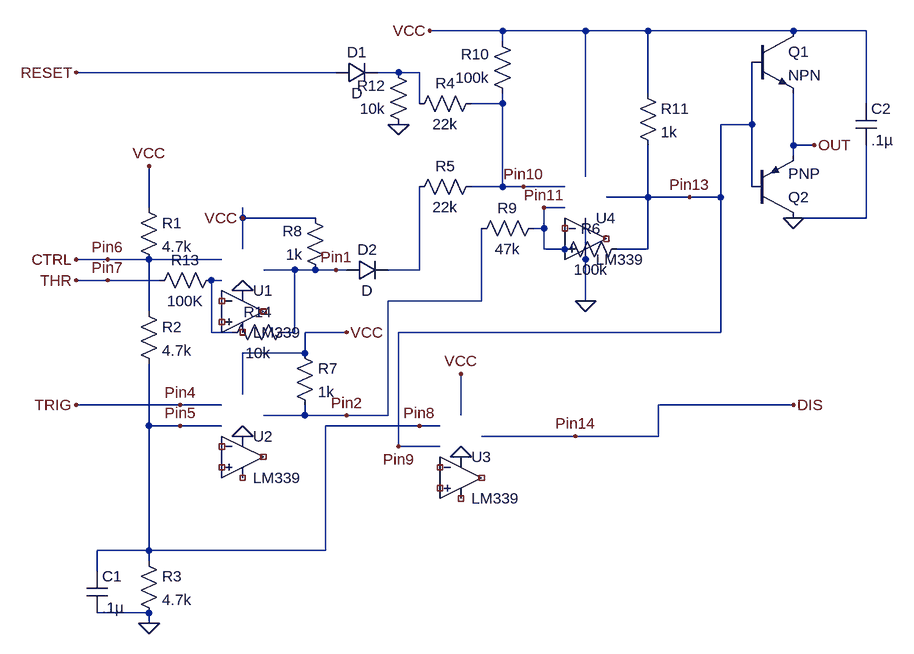
[diagram p0: schematic 555_linear.asc]
555_linear.asc, the LTspice schematic file:
Version 4
SHEET 1 1280 708
WIRE 672 -224 560 -224
WIRE 800 -224 672 -224
WIRE 896 -224 800 -224
WIRE 1120 -224 896 -224
WIRE 1232 -224 1120 -224
WIRE 672 -208 672 -224
WIRE 416 -160 16 -160
WIRE 512 -160 480 -160
WIRE 544 -160 512 -160
WIRE 896 -128 896 -224
WIRE 544 -112 544 -160
WIRE 672 -112 672 -128
WIRE 672 -112 624 -112
WIRE 1232 -112 1232 -224
WIRE 1056 -80 1056 -176
WIRE 1056 -80 1008 -80
WIRE 1120 -48 1120 -128
WIRE 1152 -48 1120 -48
WIRE 1120 -32 1120 -48
WIRE 800 0 800 -224
WIRE 672 16 672 -112
WIRE 672 16 624 16
WIRE 704 16 672 16
WIRE 768 16 704 16
WIRE 1056 16 1056 -80
WIRE 896 32 896 -48
WIRE 896 32 832 32
WIRE 960 32 896 32
WIRE 1008 32 1008 -80
WIRE 1008 32 960 32
WIRE 128 48 128 -16
WIRE 768 48 736 48
WIRE 272 64 272 48
WIRE 384 64 272 64
WIRE 1232 64 1232 -48
WIRE 1232 64 1120 64
WIRE 736 80 736 48
WIRE 736 80 720 80
WIRE 272 112 272 64
WIRE 736 112 736 80
WIRE 768 112 736 112
WIRE 896 112 896 32
WIRE 896 112 848 112
WIRE 64 128 16 128
WIRE 128 128 64 128
WIRE 240 128 128 128
WIRE 352 144 304 144
WIRE 384 144 352 144
WIRE 416 144 384 144
WIRE 432 144 416 144
WIRE 544 144 544 16
WIRE 544 144 496 144
WIRE 64 160 16 160
WIRE 144 160 64 160
WIRE 240 160 224 160
WIRE 640 192 640 80
WIRE 640 192 496 192
WIRE 800 192 800 64
WIRE 128 208 128 128
WIRE 224 240 224 160
WIRE 256 240 224 240
WIRE 352 240 352 144
WIRE 352 240 336 240
WIRE 432 240 368 240
WIRE 1008 240 1008 32
WIRE 1008 240 512 240
WIRE 368 272 368 240
WIRE 368 272 272 272
WIRE 272 336 272 272
WIRE 176 352 16 352
WIRE 240 352 176 352
WIRE 1120 352 912 352
WIRE 368 368 368 352
WIRE 368 368 304 368
WIRE 432 368 368 368
WIRE 496 368 496 192
WIRE 496 368 432 368
WIRE 608 368 608 304
WIRE 128 384 128 288
WIRE 176 384 128 384
WIRE 240 384 176 384
WIRE 544 384 400 384
WIRE 576 384 544 384
WIRE 784 400 640 400
WIRE 912 400 912 352
WIRE 912 400 784 400
WIRE 512 416 512 240
WIRE 576 416 512 416
WIRE 128 576 128 384
WIRE 128 576 48 576
WIRE 400 576 400 384
WIRE 400 576 128 576
WIRE 128 592 128 576
WIRE 48 608 48 576
WIRE 128 672 48 672
WIRE 128 688 128 672
FLAG 272 176 0
FLAG 272 400 0
FLAG 272 64 VCC
FLAG 432 240 VCC
FLAG 16 160 THR
FLAG 16 128 CTRL
FLAG 16 352 TRIG
FLAG 128 688 0
FLAG 128 -16 VCC
FLAG 16 -160 RESET
FLAG 608 432 0
FLAG 608 304 VCC
FLAG 1120 352 DIS
FLAG 1152 -48 OUT
FLAG 800 192 0
FLAG 560 -224 VCC
FLAG 1120 64 0
FLAG 512 -80 0
FLAG 432 368 Pin2
FLAG 416 144 Pin1
FLAG 960 32 Pin13
FLAG 784 400 Pin14
FLAG 176 352 Pin4
FLAG 176 384 Pin5
FLAG 64 160 Pin7
FLAG 64 128 Pin6
FLAG 544 384 Pin8
FLAG 704 16 Pin10
FLAG 512 416 Pin9
FLAG 736 48 Pin11
SYMBOL res 112 32 R0
SYMATTR InstName R1
SYMATTR Value 4.7k
SYMBOL res 112 192 R0
SYMATTR InstName R2
SYMATTR Value 4.7k
SYMBOL res 112 576 R0
SYMATTR InstName R3
SYMATTR Value 4.7k
SYMBOL Comparators\\LM339 272 144 R0
SYMATTR InstName U1
SYMBOL Comparators\\LM339 272 368 R0
SYMATTR InstName U2
SYMBOL res 352 256 R0
SYMATTR InstName R7
SYMATTR Value 1k
SYMBOL Comparators\\LM339 608 400 R0
SYMATTR InstName U3
SYMBOL res 640 -128 R90
WINDOW 0 0 56 VBottom 2
WINDOW 3 32 56 VTop 2
SYMATTR InstName R4
SYMATTR Value 22k
SYMBOL res 640 0 R90
WINDOW 0 0 56 VBottom 2
WINDOW 3 32 56 VTop 2
SYMATTR InstName R5
SYMATTR Value 22k
SYMBOL Comparators\\LM339 800 32 R0
SYMATTR InstName U4
SYMBOL res 864 96 R90
WINDOW 0 0 56 VBottom 2
WINDOW 3 32 56 VTop 2
SYMATTR InstName R6
SYMATTR Value 100k
SYMBOL res 736 64 R90
WINDOW 0 0 56 VBottom 2
WINDOW 3 32 56 VTop 2
SYMATTR InstName R9
SYMATTR Value 47k
SYMBOL res 688 -112 R180
WINDOW 0 36 76 Left 2
WINDOW 3 36 40 Left 2
SYMATTR InstName R10
SYMATTR Value 100k
SYMBOL res 400 160 R180
WINDOW 0 36 76 Left 2
WINDOW 3 36 40 Left 2
SYMATTR InstName R8
SYMATTR Value 1k
SYMBOL npn 1056 -224 R0
SYMATTR InstName Q1
SYMBOL pnp 1056 64 M180
SYMATTR InstName Q2
SYMBOL res 880 -144 R0
SYMATTR InstName R11
SYMATTR Value 1k
SYMBOL diode 416 -144 R270
WINDOW 0 32 32 VTop 2
WINDOW 3 0 32 VBottom 2
SYMATTR InstName D1
SYMBOL diode 432 160 R270
WINDOW 0 32 32 VTop 2
WINDOW 3 0 32 VBottom 2
SYMATTR InstName D2
SYMBOL res 528 -64 R180
WINDOW 0 36 76 Left 2
WINDOW 3 36 40 Left 2
SYMATTR InstName R12
SYMATTR Value 10k
SYMBOL cap 32 608 R0
SYMATTR InstName C1
SYMATTR Value .1µ
SYMBOL res 240 144 R90
WINDOW 0 0 56 VBottom 2
WINDOW 3 32 56 VTop 2
SYMATTR InstName R13
SYMATTR Value 100K
SYMBOL res 352 224 R90
WINDOW 0 0 56 VBottom 2
WINDOW 3 32 56 VTop 2
SYMATTR InstName R14
SYMATTR Value 10k
SYMBOL cap 1216 -112 R0
SYMATTR InstName C2
SYMATTR Value .1µ

The netlist it stands for:
* 555_linear.asc
R1 VCC Pin6 4.7k
R2 Pin6 Pin8 4.7k
R3 Pin8 0 4.7k
XU1 NC_01 NC_02 0 NC_03 NC_04 LM339  ; pins In+ In- V+ V- OUT
XU2 NC_05 NC_06 0 NC_07 NC_08 LM339  ; pins In+ In- V+ V- OUT
R7 VCC Pin2 1k
XU3 NC_09 NC_10 0 NC_11 NC_12 LM339  ; pins In+ In- V+ V- OUT
R4 Pin10 N001 22k
R5 Pin10 N002 22k
XU4 Pin11 NC_13 0 0 NC_14 LM339  ; pins In+ In- V+ V- OUT
R6 Pin9 Pin11 100k
R9 Pin11 Pin2 47k
R10 Pin10 VCC 100k
R8 Pin1 VCC 1k
Q1 VCC Pin9 OUT 0 NPN
Q2 0 Pin9 OUT 0 PNP
R11 VCC Pin9 1k
D1 RESET N001 D
D2 Pin1 N002 D
R12 0 N001 10k
C1 Pin8 0 .1µ
R13 N003 Pin7 100K
R14 Pin1 N003 10k
C2 VCC 0 .1µ
.model D D
.lib standard.dio
.model NPN NPN
.model PNP PNP
.lib standard.bjt
.lib LM339.sub
.backanno
.end